# Altium schematic sheet 04-USB2_Hub_BoardControlPeripherals.SchDoc
size B; SheetNumber: 4; SheetTotal: 14
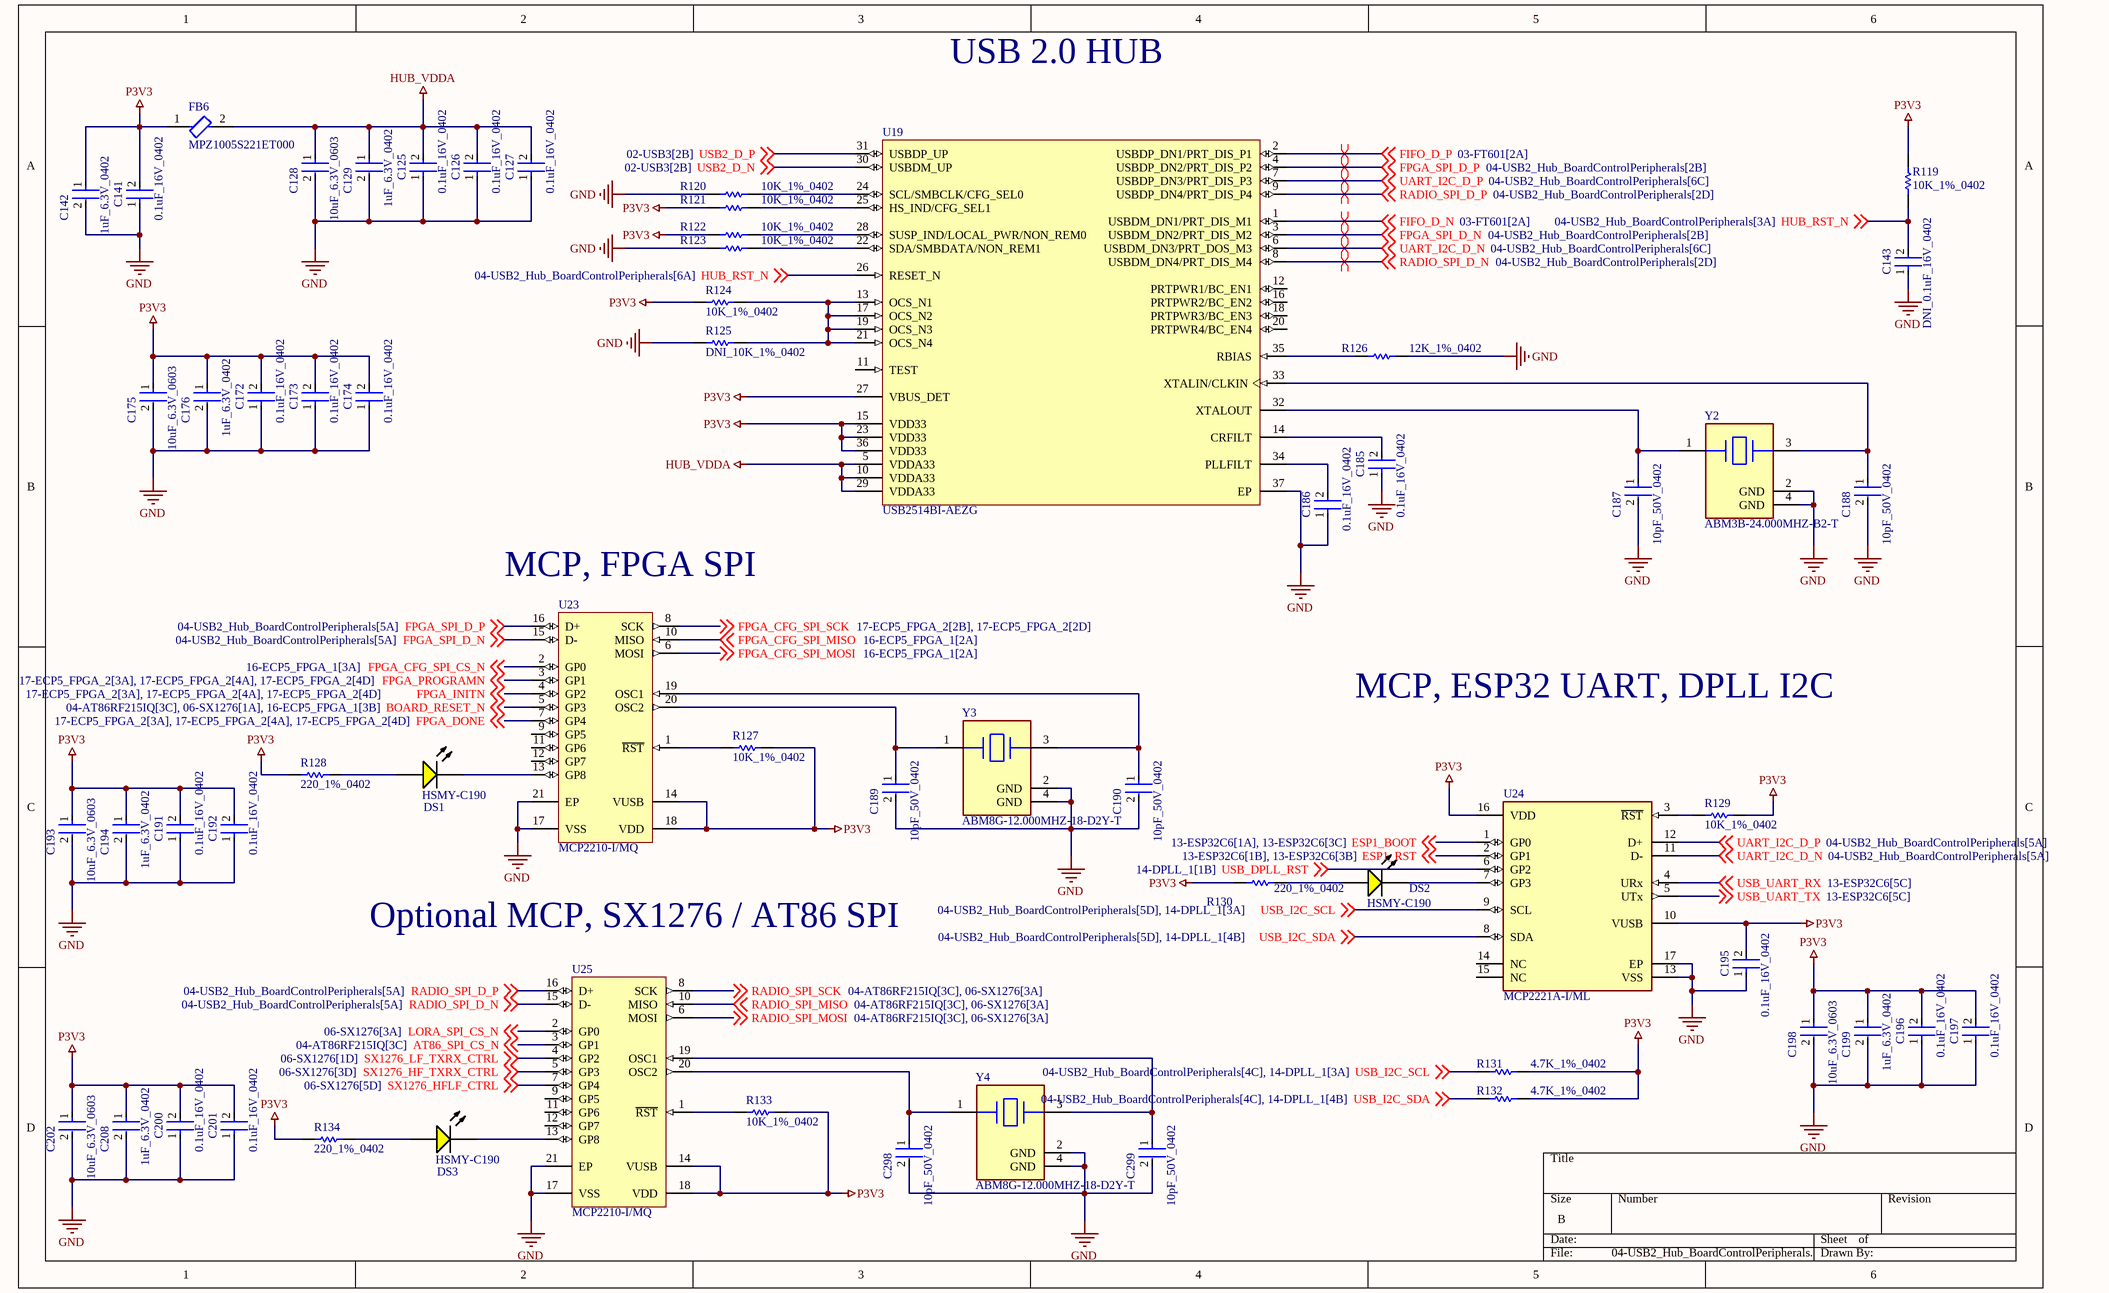
[diagram p0: 04-USB2_Hub_BoardControlPeripherals.SchDoc]

## Parts
C125  0.1uF_16V_0402  [FP-C0402-BB-MFG]
C126  0.1uF_16V_0402  [FP-C0402-BB-MFG]
C127  0.1uF_16V_0402  [FP-C0402-BB-MFG]
C128  10uF_6.3V_0603  [FP-GRM188-0_1-e0_2_0_55-IPC_A]
C129  1uF_6.3V_0402  [FP-CC0402-MFG]
C141  0.1uF_16V_0402  [FP-C0402-BB-MFG]
C142  1uF_6.3V_0402  [FP-CC0402-MFG]
C143  DNI_0.1uF_16V_0402  [FP-C0402-BB-MFG]  (no BOM)
C172  0.1uF_16V_0402  [FP-C0402-BB-MFG]
C173  0.1uF_16V_0402  [FP-C0402-BB-MFG]
C174  0.1uF_16V_0402  [FP-C0402-BB-MFG]
C175  10uF_6.3V_0603  [FP-GRM188-0_1-e0_2_0_55-IPC_A]
C176  1uF_6.3V_0402  [FP-CC0402-MFG]
C185  0.1uF_16V_0402  [FP-C0402-BB-MFG]
C186  0.1uF_16V_0402  [FP-C0402-BB-MFG]
C187  10pF_50V_0402  [FP-C0402-BB-MFG]
C188  10pF_50V_0402  [FP-C0402-BB-MFG]
C189  10pF_50V_0402  [FP-C0402-BB-MFG]
C190  10pF_50V_0402  [FP-C0402-BB-MFG]
C191  0.1uF_16V_0402  [FP-C0402-BB-MFG]
C192  0.1uF_16V_0402  [FP-C0402-BB-MFG]
C193  10uF_6.3V_0603  [FP-GRM188-0_1-e0_2_0_55-IPC_A]
C194  1uF_6.3V_0402  [FP-CC0402-MFG]
C195  0.1uF_16V_0402  [FP-C0402-BB-MFG]
C196  0.1uF_16V_0402  [FP-C0402-BB-MFG]
C197  0.1uF_16V_0402  [FP-C0402-BB-MFG]
C198  10uF_6.3V_0603  [FP-GRM188-0_1-e0_2_0_55-IPC_A]
C199  1uF_6.3V_0402  [FP-CC0402-MFG]
C200  0.1uF_16V_0402  [FP-C0402-BB-MFG]
C201  0.1uF_16V_0402  [FP-C0402-BB-MFG]
C202  10uF_6.3V_0603  [FP-GRM188-0_1-e0_2_0_55-IPC_A]
C208  1uF_6.3V_0402  [FP-CC0402-MFG]
C298  10pF_50V_0402  [FP-C0402-BB-MFG]
C299  10pF_50V_0402  [FP-C0402-BB-MFG]
DS1  HSMY-C190  [AVAG-HSMX-C190_V]
DS2  HSMY-C190  [AVAG-HSMX-C190_V]
DS3  HSMY-C190  [AVAG-HSMX-C190_V]
FB6  MPZ1005S221ET000  [FP-MPZ1005-IPC_A]
R119  10K_1%_0402  [RESC1005X40X25NL10T10]
R120  10K_1%_0402  [RESC1005X40X25NL10T10]
R121  10K_1%_0402  [RESC1005X40X25NL10T10]
R122  10K_1%_0402  [RESC1005X40X25NL10T10]
R123  10K_1%_0402  [RESC1005X40X25NL10T10]
R124  10K_1%_0402  [RESC1005X40X25NL10T10]
R125  DNI_10K_1%_0402  [RESC1005X40X25NL10T10]  (no BOM)
R126  12K_1%_0402  [RESC1005X40X25LL10T10]
R127  10K_1%_0402  [RESC1005X40X25NL10T10]
R128  220_1%_0402  [RESC1005X40X25LL05T05]
R129  10K_1%_0402  [RESC1005X40X25NL10T10]
R130  220_1%_0402  [RESC1005X40X25LL05T05]
R131  4.7K_1%_0402  [RESC1005X40X25NL05T10]
R132  4.7K_1%_0402  [RESC1005X40X25NL05T10]
R133  10K_1%_0402  [RESC1005X40X25NL10T10]
R134  220_1%_0402  [RESC1005X40X25LL05T05]
U19  USB2514BI-AEZG  [MCHP-QFN-36_V]
U23  MCP2210-I/MQ  [QFN-MQ20_L]
U24  MCP2221A-I/ML  [FP-C04-127-MFG]
U25  MCP2210-I/MQ  [QFN-MQ20_L]
Y2  ABM3B-24.000MHZ-B2-T  [FP-ABM3B-MFG]
Y3  ABM8G-12.000MHZ-18-D2Y-T  [FP-ABM8G-MFG]
Y4  ABM8G-12.000MHZ-18-D2Y-T  [FP-ABM8G-MFG]

## Nets
GND: C125.1 C126.1 C127.1 C128.2 C129.2 C141.1 C142.2 C143.1 C172.1 C173.1 C174.1 C175.2 C176.2 C185.1 C186.1 C187.2 C188.2 C189.2 C190.2 C191.1 C192.1 C193.2 C194.2 C195.1 C196.1 C197.1 C198.2 C199.2 C200.1 C201.1 C202.2 C208.2 C298.2 C299.2 R120.1 R123.1 R125.1 R126.2 U19.37(EP) U23.17(VSS) U23.21(EP) U24.13(VSS) U24.17(EP) U25.17(VSS) U25.21(EP) Y2.2(GND) Y2.4(GND) Y3.2(GND) Y3.4(GND) Y4.2(GND) Y4.4(GND)
HUB_VDDA: C125.2 C126.2 C127.2 C128.1 C129.1 FB6.2 U19.5(VDDA33) U19.10(VDDA33) U19.29(VDDA33)
P3V3: C141.2 C142.1 C172.2 C173.2 C174.2 C175.1 C176.1 C191.2 C192.2 C193.1 C194.1 C195.2 C196.2 C197.2 C198.1 C199.1 C200.2 C201.2 C202.1 C208.1 FB6.1 R119.2 R121.1 R122.1 R124.1 R127.2 R128.1 R129.2 R130.1 R131.2 R132.2 R133.2 R134.1 U19.15(VDD33) U19.23(VDD33) U19.27(VBUS_DET) U19.36(VDD33) U23.14(VUSB) U23.18(VDD) U24.10(VUSB) U24.16(VDD) U25.14(VUSB) U25.18(VDD)
AT86_SPI_CS_N: U25.3(GP1) ; off-sheet AT86_SPI_CS_N
BOARD_RESET_N: U23.5(GP3) ; off-sheet BOARD_RESET_N
ESP1_BOOT: U24.1(GP0) ; off-sheet ESP1_BOOT
ESP1_RST: U24.2(GP1) ; off-sheet ESP1_RST
FIFO_D_N: U19.1(USBDM_DN1/PRT_DIS_M1) ; off-sheet FIFO_D_N
FIFO_D_P: U19.2(USBDP_DN1/PRT_DIS_P1) ; off-sheet FIFO_D_P
FPGA_CFG_SPI_CS_N: U23.2(GP0) ; off-sheet FPGA_CFG_SPI_CS_N
FPGA_CFG_SPI_MISO: U23.10(MISO) ; off-sheet FPGA_CFG_SPI_MISO
FPGA_CFG_SPI_MOSI: U23.6(MOSI) ; off-sheet FPGA_CFG_SPI_MOSI
FPGA_CFG_SPI_SCK: U23.8(SCK) ; off-sheet FPGA_CFG_SPI_SCK
FPGA_DONE: U23.7(GP4) ; off-sheet FPGA_DONE
FPGA_INITN: U23.4(GP2) ; off-sheet FPGA_INITN
FPGA_PROGRAMN: U23.3(GP1) ; off-sheet FPGA_PROGRAMN
FPGA_SPI_D_N: U19.3(USBDM_DN2/PRT_DIS_M2) U23.15(D-) ; off-sheet FPGA_SPI_D_N
FPGA_SPI_D_P: U19.4(USBDP_DN2/PRT_DIS_P2) U23.16(D+) ; off-sheet FPGA_SPI_D_P
HUB_RST_N: C143.2 R119.1 U19.26(RESET_N) ; off-sheet HUB_RST_N
LORA_SPI_CS_N: U25.2(GP0) ; off-sheet LORA_SPI_CS_N
RADIO_SPI_D_N: U19.8(USBDM_DN4/PRT_DIS_M4) U25.15(D-) ; off-sheet RADIO_SPI_D_N
RADIO_SPI_D_P: U19.9(USBDP_DN4/PRT_DIS_P4) U25.16(D+) ; off-sheet RADIO_SPI_D_P
RADIO_SPI_MISO: U25.10(MISO) ; off-sheet RADIO_SPI_MISO
RADIO_SPI_MOSI: U25.6(MOSI) ; off-sheet RADIO_SPI_MOSI
RADIO_SPI_SCK: U25.8(SCK) ; off-sheet RADIO_SPI_SCK
SX1276_HF_TXRX_CTRL: U25.5(GP3) ; off-sheet SX1276_HF_TXRX_CTRL
SX1276_HFLF_CTRL: U25.7(GP4) ; off-sheet SX1276_HFLF_CTRL
SX1276_LF_TXRX_CTRL: U25.4(GP2) ; off-sheet SX1276_LF_TXRX_CTRL
UART_I2C_D_N: U19.6(USBDM_DN3/PRT_DOS_M3) U24.11(D-) ; off-sheet UART_I2C_D_N
UART_I2C_D_P: U19.7(USBDP_DN3/PRT_DIS_P3) U24.12(D+) ; off-sheet UART_I2C_D_P
USB2_D_N: U19.30(USBDM_UP) ; off-sheet USB2_D_N
USB2_D_P: U19.31(USBDP_UP) ; off-sheet USB2_D_P
USB_DPLL_RST: U24.6(GP2) ; off-sheet USB_DPLL_RST
USB_I2C_SCL: R131.1 U24.9(SCL) ; off-sheet USB_I2C_SCL
USB_I2C_SDA: R132.1 U24.8(SDA) ; off-sheet USB_I2C_SDA
USB_UART_RX: U24.4(URx) ; off-sheet USB_UART_RX
USB_UART_TX: U24.5(UTx) ; off-sheet USB_UART_TX
NetC185_2: C185.2 U19.14(CRFILT)
NetC186_2: C186.2 U19.34(PLLFILT)
NetC187_1: C187.1 U19.32(XTALOUT) Y2.1
NetC188_1: C188.1 U19.33(XTALIN/CLKIN) Y2.3
NetC189_1: C189.1 U23.20(OSC2) Y3.1
NetC190_1: C190.1 U23.19(OSC1) Y3.3
NetC298_1: C298.1 U25.20(OSC2) Y4.1
NetC299_1: C299.1 U25.19(OSC1) Y4.3
NetDS1_1: DS1.1(A) R128.2
NetDS1_2: DS1.2(K) U23.13(GP8)
NetDS2_1: DS2.1(A) R130.2
NetDS2_2: DS2.2(K) U24.7(GP3)
NetDS3_1: DS3.1(A) R134.2
NetDS3_2: DS3.2(K) U25.13(GP8)
NetR120_2: R120.2 U19.24(SCL/SMBCLK/CFG_SEL0)
NetR121_2: R121.2 U19.25(HS_IND/CFG_SEL1)
NetR122_2: R122.2 U19.28(SUSP_IND/LOCAL_PWR/NON_REM0)
NetR123_2: R123.2 U19.22(SDA/SMBDATA/NON_REM1)
NetR124_2: R124.2 R125.2 U19.13(OCS_N1) U19.17(OCS_N2) U19.19(OCS_N3) U19.21(OCS_N4)
NetR126_1: R126.1 U19.35(RBIAS)
NetR127_1: R127.1 U23.1(~{RST})
NetR129_1: R129.1 U24.3(~{RST})
NetR133_1: R133.1 U25.1(~{RST})

Not connected (* = marked no-connect by the designer): U19 11(TEST) 12(PRTPWR1/BC_EN1) 16(PRTPWR2/BC_EN2) 18(PRTPWR3/BC_EN3) 20(PRTPWR4/BC_EN4); U23 9(GP5) 11(GP6) 12(GP7); U24 14(NC) 15(NC); U25 9(GP5) 11(GP6) 12(GP7)

## Layout directives
differential pair: FIFO_D_N, FIFO_D_P, FPGA_SPI_D_N, FPGA_SPI_D_P, RADIO_SPI_D_N, RADIO_SPI_D_P, UART_I2C_D_N, UART_I2C_D_P

## Notes on the sheet
- USB 2.0 HUB
- (near U23) MCP, FPGA SPI
- MCP, ESP32 UART, DPLL I2C
- Optional MCP, SX1276 / AT86 SPI

## Library data of the parts
C125-C127 C141 C143 C172-C174 C185 C186 C191 C192 C195-C197 C200 C201 = CMP-1034-02068-3: CAP CER 0.1UF 16V 5% X7R 0402; Manufacturer: Kemet; Manufacturer Part Number: C0402C104J4RACTU; Value: 0.10 μF; Temperature Coefficient: 15%; Tolerance: 0.05; Material: Ceramic; ComponentLink2URL: https://content.kemet.com/datasheets/KEM_C1002_X7R_SMD.pdf; Automotive: No; Device Class L2: Capacitors; Temperature: -55°C to +125°C; RoHS: TRUE; Voltage Rating: 16 V; ComponentLink2Description: Datasheet; Device Class L3: Ceramic Capacitors; Temperature Range Low: -55°C; Ipc Land Pattern Name: CAPC10050X50; Device Class L1: Passive Components; Temperature Range High: +125°C; Package: C0402-BB; Capacitance: 0.10 μF; Category: Cap; Mouser Description: CAP CER 0.1UF 16V X7R 0402; Height: 0.55mm; Digikey Description: CAP CER 0.1UF 16V 5% X7R 0402; Octopart: https://octopart.com/c0402c104j4ractu-kemet-12573893; Temperature Characteristic: X7R; Lead Free: Yes
C128 C175 C193 C198 C202 = CMP-2006-02792-2: Chip Multilayer Ceramic Capacitors for General Purpose, 0603, 10uF, X5R, 15%, 20%, 6.3V; Packaging: Tape and Reel; Voltage Rating (DC): 6.3V; Width: 0.031inch; Termination: SMD/SMT; Dielectric: X5R; Package Quantity: 4000; Voltage Rating: 6.3V; Capacitance: 10uF; Case/Package: 0603; Min Operating Temperature: -55°C; Voltage: 6.3V; Length: 1.6mm; Thickness: 0.035inch; Lead Free: Lead Free; Depth: 0.8mm; Case Code (Imperial): 0603; Max Operating Temperature: 85°C; Material: Ceramic; Height: 0.8mm; Tolerance: 20%; Mount: Surface Mount; REACH SVHC: No SVHC; Radiation Hardening: No; Case Code (Metric): 1608
C129 C142 C176 C194 C199 C208 = CMP-2100-03591-2: CAP CER 1UF 6.3V X5R 0402; Manufacturer: YAGEO; Manufacturer Part Number: CC0402KRX5R5BB105; Automotive Grade: NA; Material: Ceramic; Tolerance: 0.1; Temperature Coefficient: 30ppm/°C; Voltage Rating: 6.3 V; Temperature Range Low: -55°C; Digikey Description: CAP CER 1UF 6.3V X5R 0402; Capacitance: 1 uF; Height: 0.55mm; Automotive: No; ComponentLink2URL: http://www.yageo.com/documents/recent/UPY-GP_NP0_16V-to-50V_16.pdf; Device Class L2: Capacitors; RoHS: TRUE; Temperature Range High: +125°C; Device Class L3: Ceramic Capacitors; Device Class L1: Passive Components; Temperature Characteristic: X5R; Package: CC0402; Octopart: https://octopart.com/cc0402krx5r5bb105-yageo-42244618; ComponentLink2Description: Datasheet; Temperature: -55°C to +125°C; Mouser Description: Multilayer Ceramic Capacitors MLCC - SMD/SMT 1uF 6.3V X5R 10%; Category: Cap; Footprint Url: http://www.yageo.com/exep/pages/download/literatures/UPY-C_GEN_24.pdf; Lead Free: Yes; Ipc Land Pattern Name: CAPC10050X50; Value: 1 uF
C187-C190 C298 C299 = CMP-2008-03404-2: Multilayer Ceramic Capacitor, C Series, 10 Pf, - 5%, C0G / Np0, 50 V, 0402 [1005 Metric] Rohs Compliant: Yes; Manufacturer Part Number: C0402C100J5GACTU; Manufacturer: Kemet; Temperature Coefficient: 15%; Voltage Rating: 50 V; Capacitance: 10 pF; Value: 10 pF; Tolerance: 0.05; Automotive: No; Temperature Range High: +125°C; ComponentLink2Description: Datasheet; Material: Ceramic; Lead Free: Yes; ComponentLink2URL: https://content.kemet.com/datasheets/KEM_C1002_X7R_SMD.pdf; Device Class L3: Ceramic Capacitors; RoHS: TRUE; Package: C0402-BB; Temperature: -55°C to +125°C; Temperature Range Low: -55°C; Height: 0.55mm; Mouser Description: Multilayer Ceramic Capacitor, C Series, 10 Pf, - 5%, C0G / Np0, 50 V, 0402 [1005 Metric] Rohs Compliant: Yes; Octopart: https://octopart.com/c0402c100j5gactu-kemet-108448; Digikey Description: Multilayer Ceramic Capacitor, C Series, 10 Pf, - 5%, C0G / Np0, 50 V, 0402 [1005 Metric] Rohs Compliant: Yes; Temperature Characteristic: C0G; Category: Cap; Ipc Land Pattern Name: CAPC10050X50; Device Class L1: Passive Components; Device Class L2: Capacitors
DS1-DS3 = CMP-1744-00003-1: LED Uni-Color Yellow, 65 mW, 20 mA, -40 to 85 degC, 2-Pin SMD, RoHS, Tape and Reel; Tolerance: 1%; Voltage Rating: 50 V; Power Rating: 100 mW; Case\Package: 0603; Resistance: 390 Ohm; Min Operating Temperature: -55 degC; Length: 1.6 mm; ComponentLink3Description: Package Specification; Mount: Surface Mount; PackageReference: HSMX-C190; ComponentLink2Description: Datasheet; DatasheetVersion: Mar-12; Case Code (Metric): 1608; Pins: 2; Package Quantity: 5000; ComponentLink2URL: http://docs.avagotech.com/docs/AV02-0551EN; ComponentLink1Description: Manufacturer URL; RoHSCompliant: true; Packaging: Tape and Reel; PackageDescription: 2-Pin Surface Mount Device, Body 1.6 x 0.8 mm, Height 0.9 mm; REACH SVHC: No SVHC; ComponentLink3URL: http://www.fairchildsemi.com/dwg/MA/MA03D.pdf; Voltage Rating (DC): 50 V; Width: 0.8 mm; ComponentLink1URL: http://www.avagotech.com/; Max Operating Temperature: 155 degC; Case Code (Imperial): 0603; Height: 0.45 mm
FB6 = CMP-08257-000226-1: Power line Ferrite Bead 220Ω @ 100MHz 0.9A DCR 0.22Ω SMD 0402; Max Current Rating: 900mA; Impedance: 220R; Number of Lines: 1; DC Resistance (DCR): 220mR; Tolerance: 25%; Mount: Surface Mount; Case Code (Metric): 1005; Height: 0.022inch; Min Operating Temperature: -55°C; Max Operating Temperature: 125°C; RoHS Compliant: Yes; Length: 0.039inch; Width: 0.02inch; Case Code (Imperial): 0402; Case/Package: 0402; Package Quantity: 10000; Max DC Current: 900mA; Core Material: Ferrite; Packaging: Tape and Reel
R119-R125 R127 R129 R133 = CMP-2002-04694-1: Manufacturer: Bourns; Part Number: CR0402-FX-1002GLF
R126 = CMP-2002-05686-1: Part Number: CRG0402F12K; Manufacturer: TE Connectivity / AMP
R128 R130 R134 = CMP-2002-01131-1: Manufacturer: Panasonic; Part Number: ERJ2RKF2200X
R131 R132 = CMP-1011-00586-2: Manufacturer: Yageo / Phycomp; Part Number: RC0402FR-074K7L
U19 = CMP-2000-05218-1: USB 2.0 Hi-Speed Hub Controller, 3 to 3.6 V, -40 to 85 degC, 36-Pin QFN, RoHS, Tape and Reel; Manufacturer: Microchip; Current - Supply: 85mA; Standards: USB2.0; Auxiliary Sense: -40degC~85degC; Other Names: Q5138631 / Q5487824 / Q7033177 / USB2514BIAEZG; Voltage - Supply: 3V~3.6V; Dynamic Catalog: USBControllers; Family: Interface-Controllers; Datasheet Version: Rev. 2.2, 02/2012; Quantity Available: Tube; Type: USB; Supplier Device Package: 36-QFN-EP(6x6); Operating Temperature: -40degC~85degC; Manufacturer URL: http://www.microchip.com/; Packaging: Tube; Interface: USB; Protocol: USB; Package / Case: 36-TQFNExposedPad; Datasheet URL: https://datasheet.ciiva.com/22650/1691496-22650784.pdf; Standard Package: 490; Minimum Quantity: USB; Category: IntegratedCircuits(ICs); Function: HubController; Internal Switch(s): 3V~3.6V
U23 U25 = CMP-0186-00190-1: USB-to-SPI Protocol Converter with GPIO (Master Mode), 20-Pin QFN, Industrial Temperature; PackageVersion: revBB, Aug-2009; ComponentLink3URL: http://www.microchip.com/stellent/groups/techpub_sg/documents/packagingspec/en012702.pdf; ComponentLink1Description: Manufacturer URL; ComponentLink1URL: http://www.microchip.com/; ComponentLink3Description: Package Specification; ComponentLink2URL: http://ww1.microchip.com/downloads/en/DeviceDoc/22288A.pdf; DatasheetVersion: revA, Dec-2011; ComponentLink2Description: Datasheet; PackageReference: QFN-MQ20; PackageDescription: 20-Lead Plastic Quad Flat, No Lead Package (MQ) - 5x5x0.9 mm Body [QFN]
U24 = CMP-06284-000031-1: IC USB TO I2C/UART 16QFN; Operating Supply Current: 13mA; Interface: I2C; Packaging: Rail/Tube; Case/Package: VQFN; Max Operating Temperature: 85°C; RoHS Compliant: Yes; Min Operating Temperature: -40°C
Y2 = CMP-1688-00008-2: Crystal 24MHz ±20ppm 18pF SMD-4 5mm x 3.2mm; ESR (Equivalent Series Resistance): 50R; Frequency Stability: 50ppm; Number of Pins: 4; Lead Free: Lead Free; Packaging: Tape and Reel; Tolerance: 20ppm; Series: ABM3B; Height: 0.043inch; Load Capacitance: 18pF; Length: 5mm; Depth: 3.2mm; Mount: Surface Mount; Resistor Type: Ceramic; Case/Package: CSMD; Termination: SMD/SMT; Width: 0.126inch; Frequency: 24MHz; Max Operating Temperature: 70°C; Frequency Tolerance: 20ppm; REACH SVHC: No SVHC; Package Quantity: 1000; Min Operating Temperature: -20°C; Series Resistance: 50R; Operating Frequency: 24 MHz
Y3 Y4 = CMP-2000-05039-3: Crystal 12MHz ±20ppm (Tol) ±30ppm (Stability) 18pF FUND 120Ω 4-Pin SMD T/R; Series Resistance: 120R; Max Operating Temperature: 85°C; Mount: Surface Mount; Width: 2.5mm; Series: ABM8G; Termination: SMD/SMT; Frequency Tolerance: 20ppm; Tolerance: 20ppm; Min Operating Temperature: -40°C; Operating Frequency: 12 MHz; Depth: 2.5mm; Load Capacitance: 18pF; Number of Pins: 4; Length: 3.2mm; Radiation Hardening: No; Frequency Stability: 30ppm; Height: 1mm; Packaging: Tape and Reel; Package Quantity: 1000; ESR (Equivalent Series Resistance): 120R; Lead Free: Lead Free; Frequency: 12MHz; Case/Package: CSMD